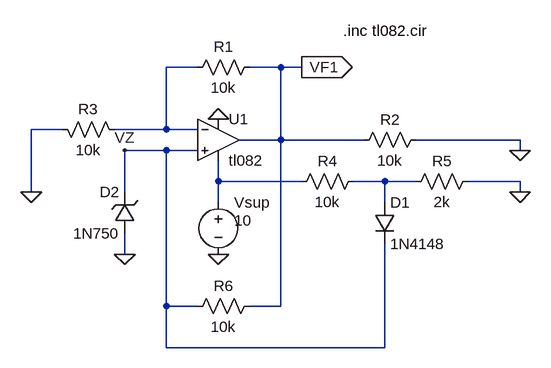
[diagram p0: schematic exp_10_2.asc]
exp_10_2.asc, the LTspice schematic file:
Version 4
SHEET 1 1092 680
WIRE 208 0 160 0
WIRE 336 0 288 0
WIRE 368 0 336 0
WIRE 0 96 -48 96
WIRE 160 96 160 0
WIRE 160 96 80 96
WIRE 208 96 160 96
WIRE 336 112 336 0
WIRE 336 112 272 112
WIRE 464 112 336 112
WIRE 704 112 544 112
WIRE 160 128 96 128
WIRE 208 128 160 128
WIRE 704 128 704 112
WIRE 240 176 240 144
WIRE 368 176 240 176
WIRE 496 176 448 176
WIRE 544 176 496 176
WIRE 704 176 624 176
WIRE -48 192 -48 96
WIRE 96 192 96 128
WIRE 704 192 704 176
WIRE 240 208 240 176
WIRE 496 208 496 176
WIRE 96 288 96 256
WIRE 160 368 160 128
WIRE 208 368 160 368
WIRE 336 368 336 112
WIRE 336 368 288 368
WIRE 160 432 160 368
WIRE 496 432 496 272
WIRE 496 432 160 432
FLAG 704 128 0
FLAG 704 192 0
FLAG -48 192 0
FLAG 240 80 0
FLAG 240 288 0
FLAG 96 288 0
FLAG 368 0 VF1
IOPIN 368 0 Out
FLAG 96 128 VZ
SYMBOL diode 480 208 R0
SYMATTR InstName D1
SYMATTR Value 1N4148
SYMBOL Opamps\\opamp2 240 48 R0
SYMATTR InstName U1
SYMATTR Value tl082
SYMBOL res 304 -16 R90
WINDOW 0 0 56 VBottom 2
WINDOW 3 32 56 VTop 2
SYMATTR InstName R1
SYMATTR Value 10k
SYMBOL res 560 96 R90
WINDOW 0 0 56 VBottom 2
WINDOW 3 32 56 VTop 2
SYMATTR InstName R2
SYMATTR Value 10k
SYMBOL res 96 112 M270
WINDOW 0 32 56 VTop 2
WINDOW 3 0 56 VBottom 2
SYMATTR InstName R3
SYMATTR Value 10k
SYMBOL res 464 160 R90
WINDOW 0 0 56 VBottom 2
WINDOW 3 32 56 VTop 2
SYMATTR InstName R4
SYMATTR Value 10k
SYMBOL res 640 160 R90
WINDOW 0 0 56 VBottom 2
WINDOW 3 32 56 VTop 2
SYMATTR InstName R5
SYMATTR Value 2k
SYMBOL res 304 352 R90
WINDOW 0 0 56 VBottom 2
WINDOW 3 32 56 VTop 2
SYMATTR InstName R6
SYMATTR Value 10k
SYMBOL voltage 240 192 R0
WINDOW 123 0 0 Left 0
WINDOW 39 0 0 Left 0
WINDOW 3 24 44 Left 2
SYMATTR InstName Vsup
SYMATTR Value 10
SYMBOL zener 112 256 R180
WINDOW 0 24 64 Left 2
WINDOW 3 24 0 Left 2
SYMATTR InstName D2
SYMATTR Value 1N750
TEXT 432 -56 Left 2 !.inc tl082.cir

The netlist it stands for:
* exp_10_2.asc
D1 N003 VZ 1N4148
XU1 VZ N001 0 N002 VF1 tl082  ; pins In+ In- V+ V- OUT
R1 VF1 N001 10k
R2 0 VF1 10k
R3 N001 0 10k
R4 N003 N002 10k
R5 0 N003 2k
R6 VF1 VZ 10k
Vsup N002 0 10
D2 0 VZ 1N750
.model D D
.lib standard.dio
.inc tl082.cir
.backanno
.end